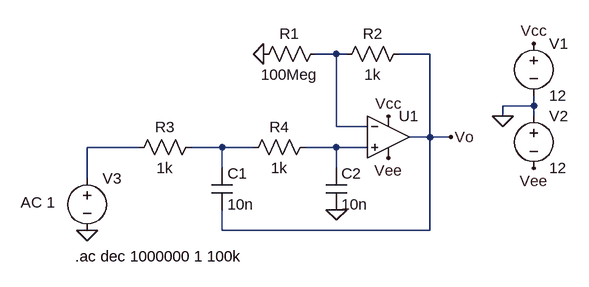
[diagram p0: schematic lowpass_filter_AC.asc]
lowpass_filter_AC.asc, the LTspice schematic file:
Version 4
SHEET 1 880 680
WIRE 112 64 80 64
WIRE 128 64 112 64
WIRE 256 64 208 64
WIRE 416 144 416 128
WIRE 416 144 368 144
WIRE 368 160 368 144
WIRE 416 160 416 144
WIRE 112 176 112 64
WIRE 160 176 112 176
WIRE 256 192 256 64
WIRE 256 192 224 192
WIRE 288 192 256 192
WIRE -192 208 -272 208
WIRE -64 208 -112 208
WIRE -16 208 -64 208
WIRE 112 208 64 208
WIRE 160 208 112 208
WIRE -64 240 -64 208
WIRE 112 240 112 208
WIRE -272 256 -272 208
WIRE -64 336 -64 304
WIRE 256 336 256 192
WIRE 256 336 -64 336
FLAG 368 160 0
FLAG 416 48 Vcc
FLAG 192 160 Vcc
FLAG 416 240 Vee
FLAG 192 224 Vee
FLAG 288 192 Vo
FLAG 112 304 0
FLAG -272 336 0
FLAG 0 64 0
SYMBOL Opamps\\UniversalOpamp2 192 192 R0
SYMATTR InstName U1
SYMBOL voltage 416 32 R0
WINDOW 123 0 0 Left 0
WINDOW 39 0 0 Left 0
SYMATTR InstName V1
SYMATTR Value 12
SYMBOL voltage 416 144 R0
WINDOW 123 0 0 Left 0
WINDOW 39 0 0 Left 0
SYMATTR InstName V2
SYMATTR Value 12
SYMBOL res 224 48 R90
WINDOW 0 0 56 VBottom 2
WINDOW 3 32 56 VTop 2
SYMATTR InstName R2
SYMATTR Value 1k
SYMBOL res -96 192 R90
WINDOW 0 0 56 VBottom 2
WINDOW 3 32 56 VTop 2
SYMATTR InstName R3
SYMATTR Value 1k
SYMBOL cap -80 240 R0
SYMATTR InstName C1
SYMATTR Value 10n
SYMBOL res 80 192 R90
WINDOW 0 0 56 VBottom 2
WINDOW 3 32 56 VTop 2
SYMATTR InstName R4
SYMATTR Value 1k
SYMBOL cap 96 240 R0
SYMATTR InstName C2
SYMATTR Value 10n
SYMBOL voltage -272 240 R0
WINDOW 3 24 152 Invisible 2
WINDOW 123 -102 53 Left 2
WINDOW 39 0 0 Left 0
SYMATTR InstName V3
SYMATTR Value ""
SYMATTR Value2 AC 1
SYMBOL res 96 48 R90
WINDOW 0 0 56 VBottom 2
WINDOW 3 32 56 VTop 2
SYMATTR InstName R1
SYMATTR Value 100Meg
TEXT -290 376 Left 2 !.ac dec 1000000 1 100k

The netlist it stands for:
* lowpass_filter_AC.asc
XU1 N004 N001 Vcc Vee Vo level.2 Avol=1Meg GBW=10Meg Slew=10Meg ilimit=25m rail=0 Vos=0 phimargin=45 en=0 enk=0 in=0 ink=0 Rin=500Meg  ; pins IN+ IN- V+ V- OUT
V1 Vcc 0 12
V2 0 Vee 12
R2 Vo N001 1k
R3 N003 N002 1k
C1 N003 Vo 10n
R4 N004 N003 1k
C2 N004 0 10n
V3 N002 0 AC 1
R1 N001 0 100Meg
.ac dec 1000000 1 100k
.lib UniversalOpamps2.sub
.backanno
.end